# Altium schematic sheet PAGE01_TITLE PAGE.SchDoc
size 246 x 182 mm
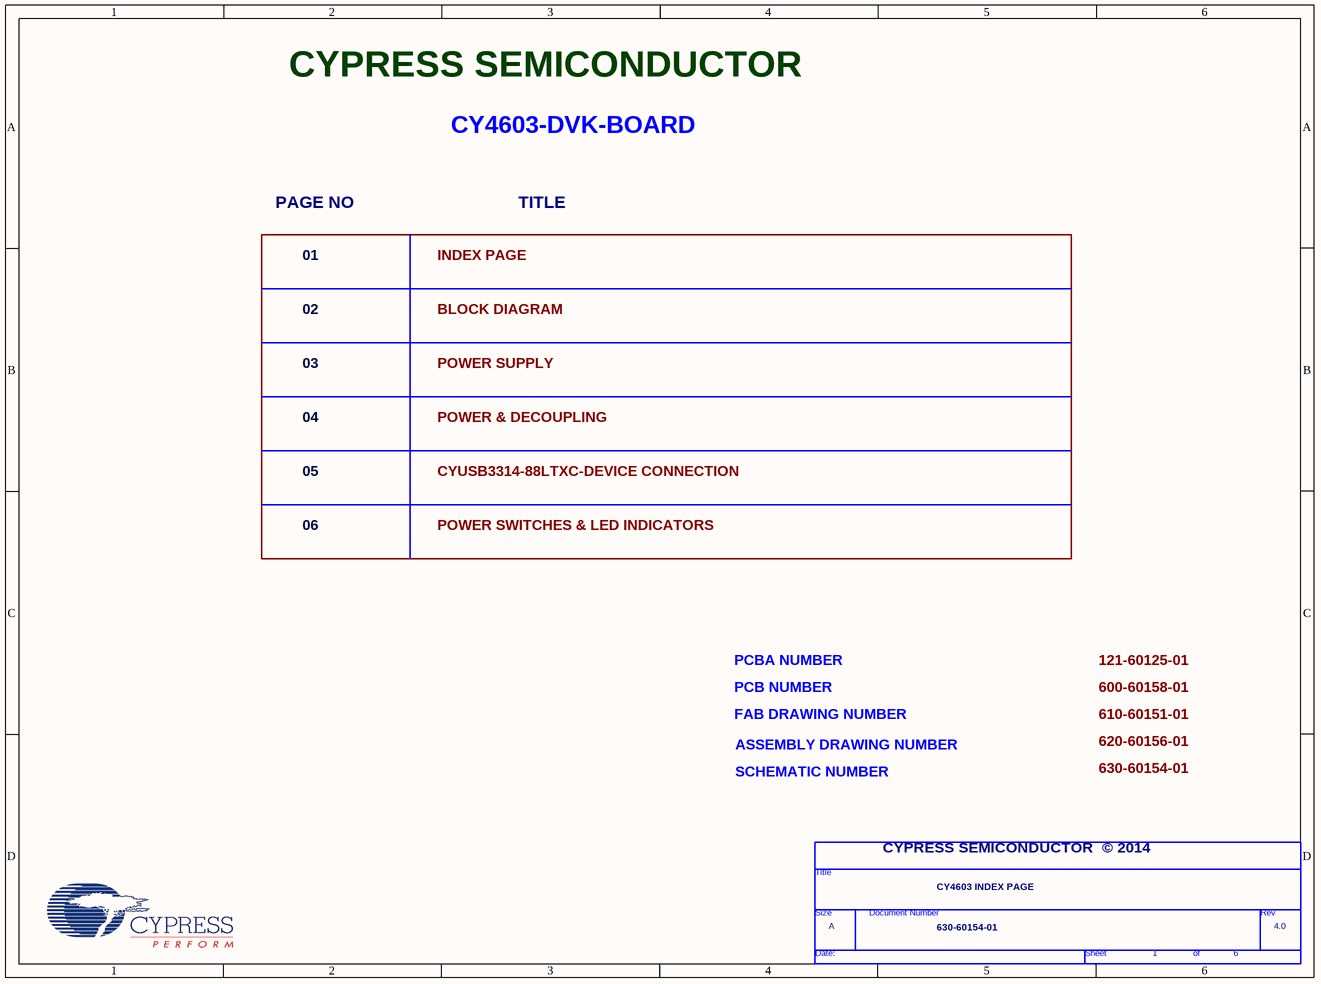
[diagram p0: PAGE01_TITLE PAGE.SchDoc]

## Parts
*  Page Count: 6  Page Number: 1  Page Size: A  Title: CY4603 INDEX PAGE  RevCode: 4.0  Doc: 630-60154-01  (hidden comment: TitleBlock0)  (graphical)

## Notes on the sheet
- CYPRESS SEMICONDUCTOR
- CY4603-DVK-BOARD
- PAGE NO
- 01
- INDEX PAGE
- TITLE
- 02
- BLOCK DIAGRAM
- 03
- POWER SUPPLY
- 04
- POWER & DECOUPLING
- 05
- 06
- CYUSB3314-88LTXC-DEVICE CONNECTION
- POWER SWITCHES & LED INDICATORS
- PCBA NUMBER
- 121-60125-01
- PCB NUMBER
- FAB DRAWING NUMBER
- 600-60158-01
- 610-60151-01
- ASSEMBLY DRAWING NUMBER
- SCHEMATIC NUMBER
- 620-60156-01
- 630-60154-01
- CYPRESS SEMICONDUCTOR  © 2014
- (in symbol TitleBlock0) Title; Size; Document Number; Rev; Date:; Sheet; of

## Library data of the parts
* = TitleBlock0: Page Create Date: March  8, 1995